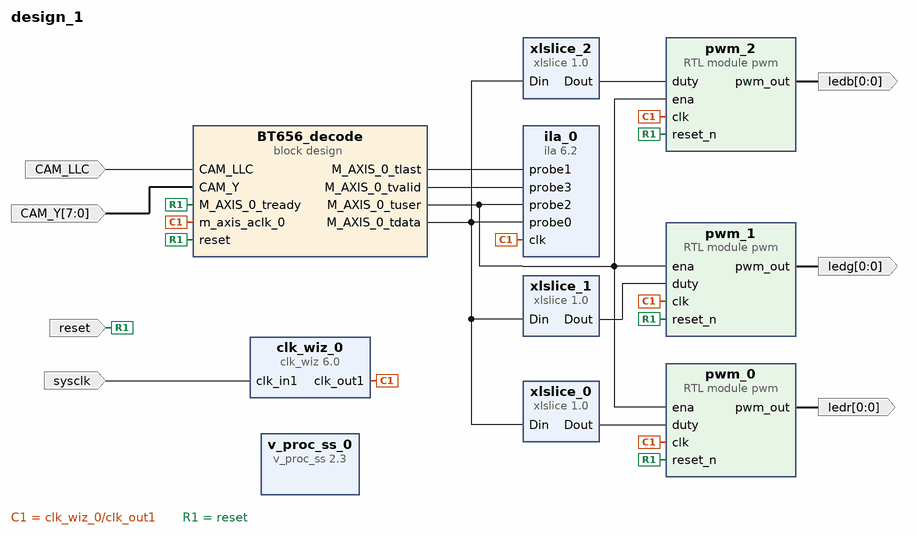
[diagram p0: block diagram of the top level]
# Vivado block design design_1, xc7z020clg400-1, Vivado 2021.2
create_bd_design design_1

create_bd_port -dir I CAM_LLC
create_bd_port -dir I -from 7 -to 0 CAM_Y
create_bd_port -dir O -from 0 -to 0 ledb
create_bd_port -dir O -from 0 -to 0 ledg
create_bd_port -dir O -from 0 -to 0 ledr
create_bd_port -dir I reset
create_bd_port -dir I -type clk sysclk
set_property -dict {CONFIG.FREQ_HZ 100000000} [get_bd_ports sysclk]

create_bd_cell -type container -reference BT656_decode BT656_decode
set_property -dict [list \
  CONFIG.ACTIVE_SIM_BD BT656_decode.bd \
  CONFIG.ACTIVE_SYNTH_BD BT656_decode.bd \
  CONFIG.ENABLE_DFX 0 \
  CONFIG.LIST_SIM_BD BT656_decode.bd \
  CONFIG.LIST_SYNTH_BD BT656_decode.bd \
  CONFIG.LOCK_PROPAGATE 0 \
] [get_bd_cells BT656_decode]
create_bd_cell -type ip -vlnv xilinx.com:ip:clk_wiz:6.0 clk_wiz_0
set_property -dict [list \
  CONFIG.CLKIN2_JITTER_PS 134.99 \
  CONFIG.CLKOUT1_JITTER 312.734 \
  CONFIG.CLKOUT1_PHASE_ERROR 234.038 \
  CONFIG.CLKOUT1_REQUESTED_OUT_FREQ 13.5 \
  CONFIG.CLK_IN1_BOARD_INTERFACE sys_clock \
  CONFIG.MMCM_CLKFBOUT_MULT_F 40.500 \
  CONFIG.MMCM_CLKIN2_PERIOD 10.000 \
  CONFIG.MMCM_CLKOUT0_DIVIDE_F 75.000 \
  CONFIG.MMCM_DIVCLK_DIVIDE 5 \
  CONFIG.SECONDARY_IN_FREQ 100.000 \
  CONFIG.SECONDARY_SOURCE Single_ended_clock_capable_pin \
  CONFIG.USE_BOARD_FLOW true \
  CONFIG.USE_INCLK_SWITCHOVER false \
  CONFIG.USE_LOCKED false \
  CONFIG.USE_RESET false \
] [get_bd_cells clk_wiz_0]
create_bd_cell -type ip -vlnv xilinx.com:ip:ila:6.2 ila_0
set_property -dict [list \
  CONFIG.C_DATA_DEPTH 131072 \
  CONFIG.C_ENABLE_ILA_AXI_MON false \
  CONFIG.C_MONITOR_TYPE Native \
  CONFIG.C_NUM_OF_PROBES 4 \
  CONFIG.C_PROBE0_WIDTH 24 \
  CONFIG.C_PROBE4_WIDTH 1 \
  CONFIG.C_PROBE7_WIDTH 1 \
] [get_bd_cells ila_0]
create_bd_cell -type ip -vlnv xilinx.com:ip:xlslice:1.0 xlslice_0
set_property -dict {CONFIG.DIN_FROM 23 CONFIG.DIN_TO 16 CONFIG.DIN_WIDTH 24 CONFIG.DOUT_WIDTH 8} [get_bd_cells xlslice_0]
create_bd_cell -type ip -vlnv xilinx.com:ip:xlslice:1.0 xlslice_1
set_property -dict {CONFIG.DIN_FROM 15 CONFIG.DIN_TO 8 CONFIG.DIN_WIDTH 24 CONFIG.DOUT_WIDTH 8} [get_bd_cells xlslice_1]
create_bd_cell -type ip -vlnv xilinx.com:ip:xlslice:1.0 xlslice_2
set_property -dict {CONFIG.DIN_FROM 7 CONFIG.DIN_WIDTH 24 CONFIG.DOUT_WIDTH 8} [get_bd_cells xlslice_2]
create_bd_cell -type module -reference pwm pwm_0
create_bd_cell -type module -reference pwm pwm_1
create_bd_cell -type module -reference pwm pwm_2
create_bd_cell -type ip -vlnv xilinx.com:ip:v_proc_ss:2.3 v_proc_ss_0
set_property -dict [list \
  CONFIG.C_AXIMM_DATA_WIDTH 128 \
  CONFIG.C_COLORSPACE_SUPPORT 2 \
  CONFIG.C_DEINT_MOTION_ADAPTIVE false \
  CONFIG.C_TOPOLOGY 2 \
] [get_bd_cells v_proc_ss_0]

# ---- connections ----

connect_bd_net [get_bd_pins BT656_decode/M_AXIS_0_tdata] \
  [get_bd_pins ila_0/probe0] [get_bd_pins xlslice_0/Din] [get_bd_pins xlslice_1/Din] [get_bd_pins xlslice_2/Din]
connect_bd_net [get_bd_pins BT656_decode/M_AXIS_0_tlast] [get_bd_pins ila_0/probe1]
connect_bd_net [get_bd_pins BT656_decode/M_AXIS_0_tuser] \
  [get_bd_pins ila_0/probe2] [get_bd_pins pwm_0/ena] [get_bd_pins pwm_1/ena] [get_bd_pins pwm_2/ena]
connect_bd_net [get_bd_pins BT656_decode/M_AXIS_0_tvalid] [get_bd_pins ila_0/probe3]
connect_bd_net [get_bd_ports CAM_LLC] [get_bd_pins BT656_decode/CAM_LLC]
connect_bd_net -net clk_in1_0_1 [get_bd_ports sysclk] [get_bd_pins clk_wiz_0/clk_in1]
connect_bd_net [get_bd_pins clk_wiz_0/clk_out1] \
  [get_bd_pins BT656_decode/m_axis_aclk_0] [get_bd_pins ila_0/clk] [get_bd_pins pwm_0/clk] [get_bd_pins pwm_1/clk] \
  [get_bd_pins pwm_2/clk]
connect_bd_net -net i_data_0_1 [get_bd_ports CAM_Y] [get_bd_pins BT656_decode/CAM_Y]
connect_bd_net [get_bd_pins pwm_0/pwm_out] [get_bd_ports ledr]
connect_bd_net [get_bd_pins pwm_1/pwm_out] [get_bd_ports ledg]
connect_bd_net [get_bd_pins pwm_2/pwm_out] [get_bd_ports ledb]
connect_bd_net -net rst_ps7_0_50M_peripheral_aresetn [get_bd_ports reset] \
  [get_bd_pins BT656_decode/reset] [get_bd_pins pwm_0/reset_n] [get_bd_pins pwm_1/reset_n] [get_bd_pins pwm_2/reset_n] \
  [get_bd_pins BT656_decode/M_AXIS_0_tready]
connect_bd_net [get_bd_pins xlslice_0/Dout] [get_bd_pins pwm_0/duty]
connect_bd_net [get_bd_pins xlslice_1/Dout] [get_bd_pins pwm_1/duty]
connect_bd_net [get_bd_pins xlslice_2/Dout] [get_bd_pins pwm_2/duty]

validate_bd_design
save_bd_design
